# Altium schematic sheet P06_PLP.SchDoc
size 420 x 297 mm
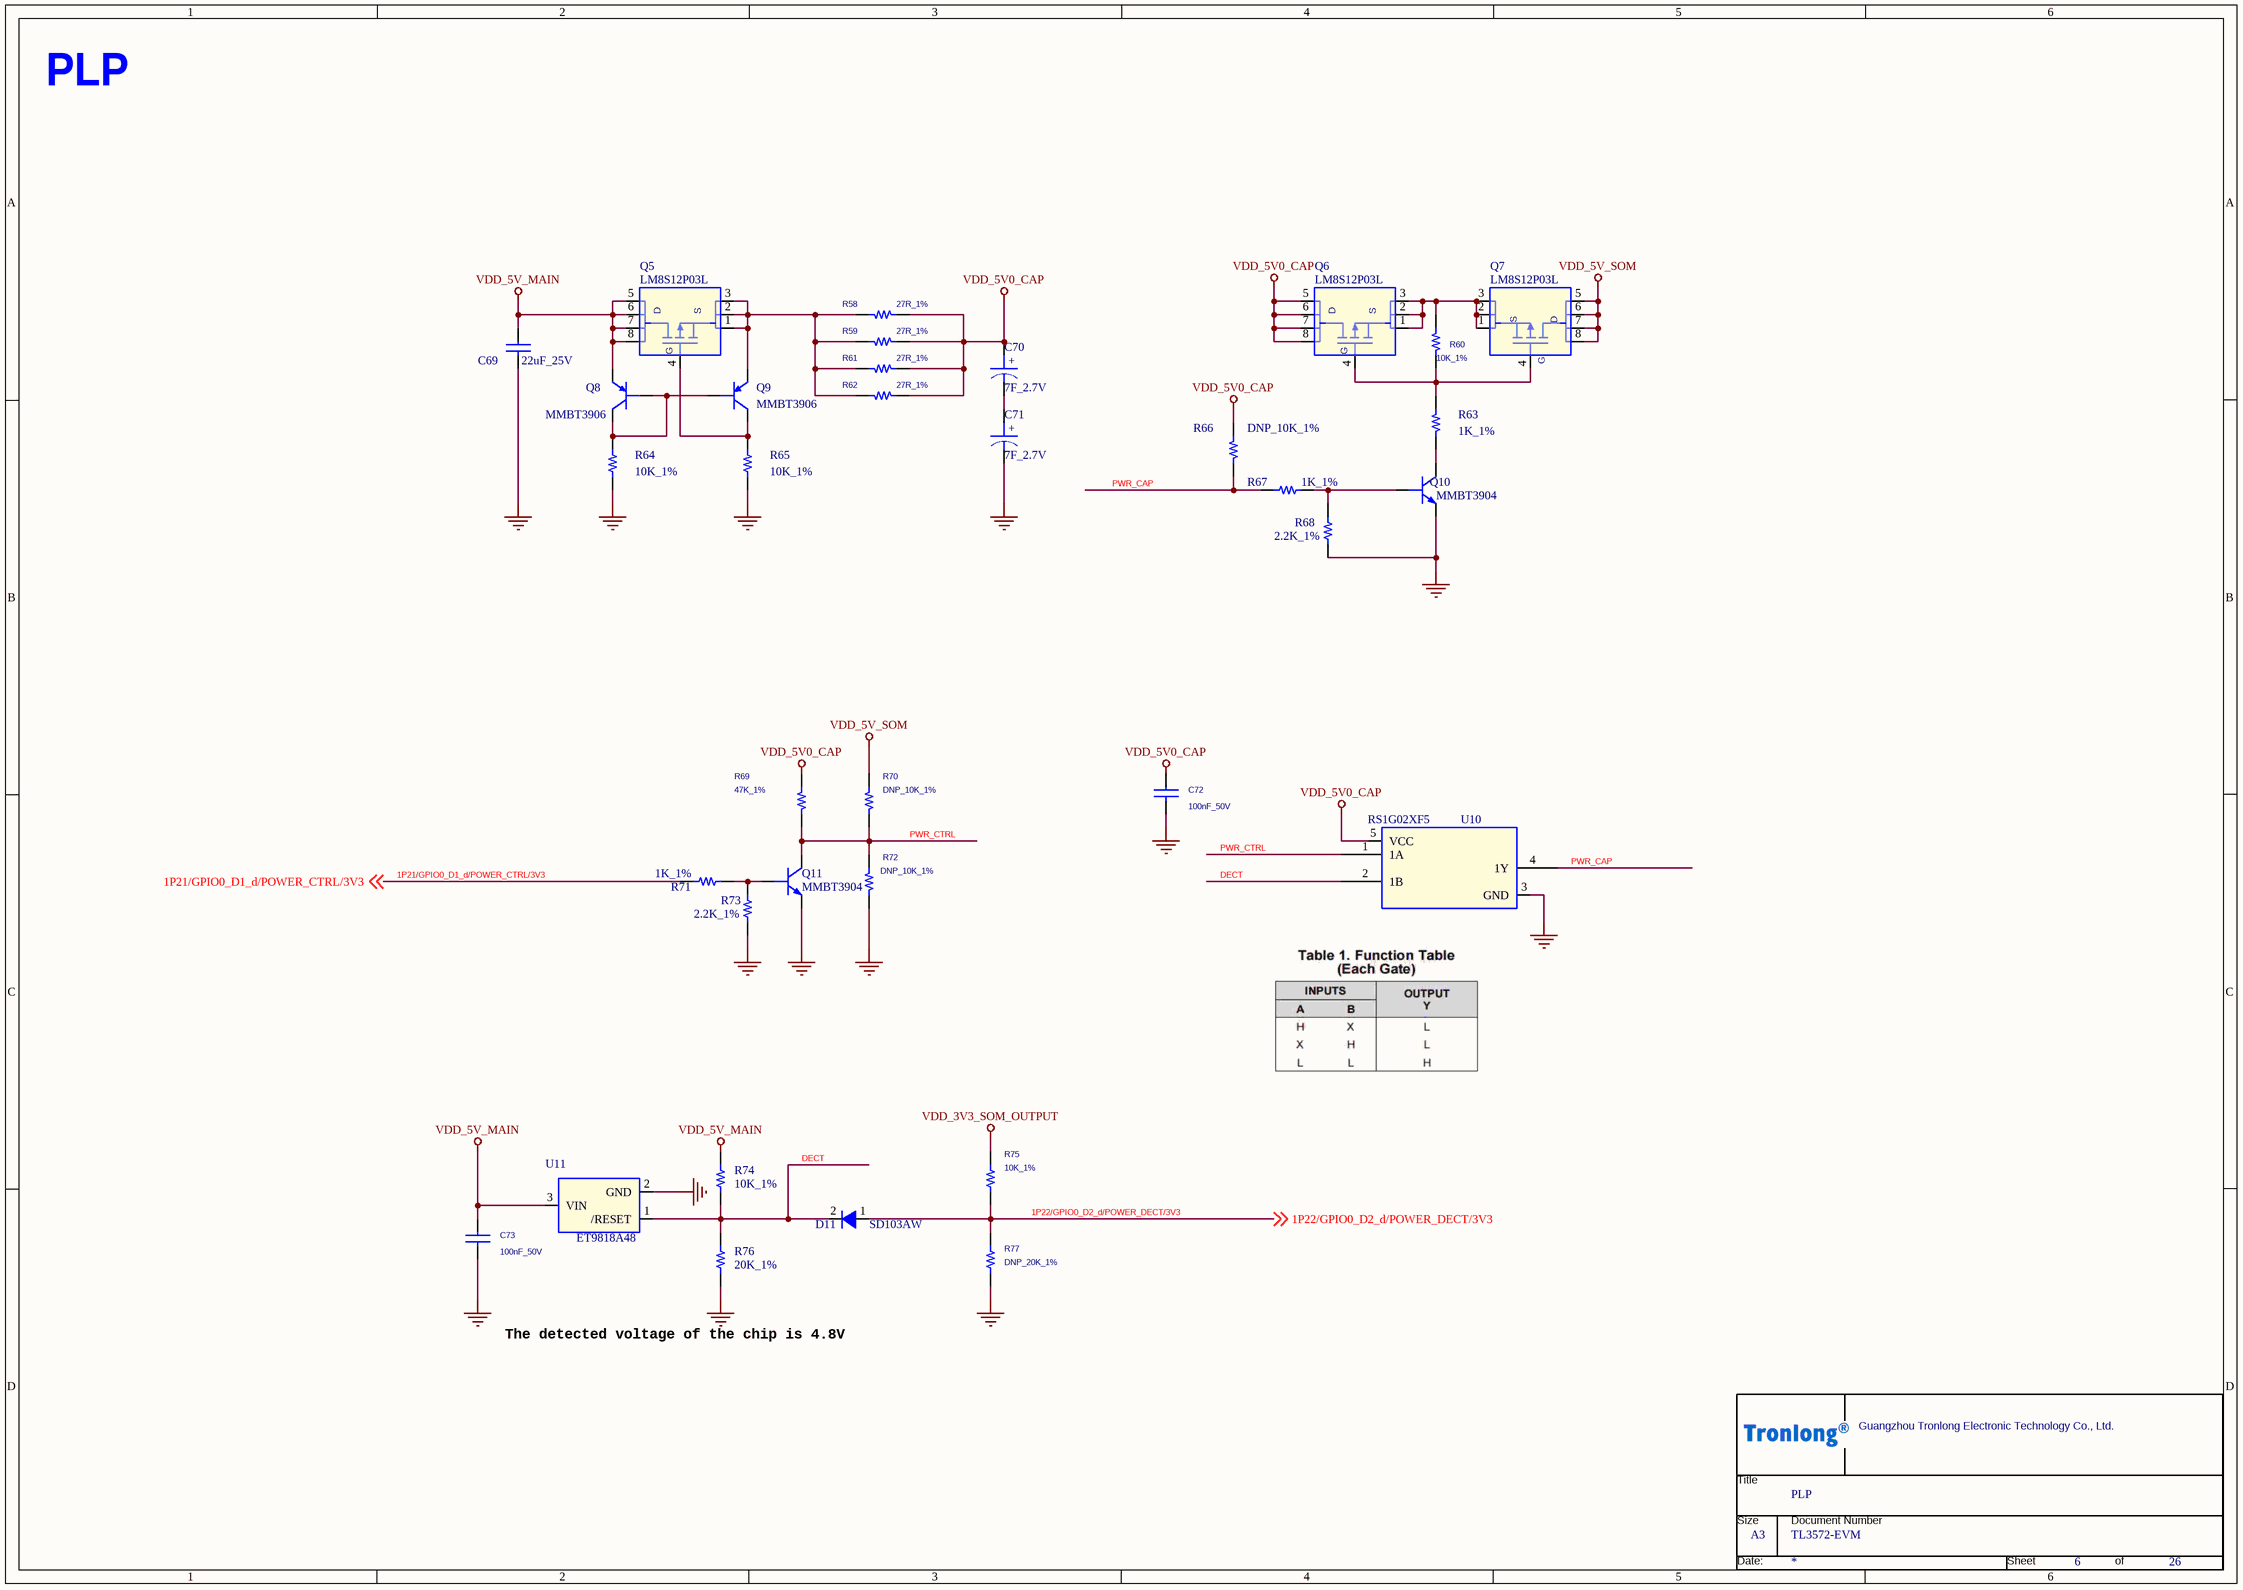
[diagram p0: P06_PLP.SchDoc]

## Parts
*  Page Count: 26  Page Number: 6  Page Size: A3  OrgName: Guangzhou Tronlong Electronic Technology Co., Ltd.  Title: PLP  Doc: TL3572-EVM  (hidden comment: TL_NEW)  (graphical)
C69  22uF_25V  [C0805]
C70  7F_2.7V  [dcc3-5_0-10_5x20_5_0-down]
C71  7F_2.7V  [dcc3-5_0-10_5x20_5_0-down]
C72  100nF_50V  [C0402]
C73  100nF_50V  [C0402]
D11  SD103AW  [SOD-123_NEW]
Q5  LM8S12P03L  [PSOPSOP-8L]
Q6  LM8S12P03L  [PSOPSOP-8L]
Q7  LM8S12P03L  [PSOPSOP-8L]
Q8  MMBT3906  [SOT23-3_DBZ3]
Q9  MMBT3906  [SOT23-3_DBZ3]
Q10  MMBT3904  [SOT23-3_DBZ3]
Q11  MMBT3904  [SOT23-3_DBZ3]
R58  27R_1%  [R2512]
R59  27R_1%  [R2512]
R60  10K_1%  [R0402]
R61  27R_1%  [R2512]
R62  27R_1%  [R2512]
R63  1K_1%  [R0402]
R64  10K_1%  [R0402]
R65  10K_1%  [R0402]
R66  DNP_10K_1%  [R0402]
R67  1K_1%  [R0402]
R68  2.2K_1%  [R0402]
R69  47K_1%  [R0402]
R70  DNP_10K_1%  [R0402]
R71  1K_1%  [R0402]
R72  DNP_10K_1%  [R0402]
R73  2.2K_1%  [R0402]
R74  10K_1%  [R0402]
R75  10K_1%  [R0402]
R76  20K_1%  [R0603]
R77  DNP_20K_1%  [R0402]
U10  RS1G02XF5  [SOT23-5]
U11  ET9818A48  [sot23-3_dbz3_1]

## Nets
GND: C69.2 C71.2 C72.2 C73.2 Q10.2(E) Q11.2(E) R64.1 R65.1 R68.2 R72.2 R73.2 R76.1 R77.2 U10.3(GND) U11.2(GND)
VDD_3V3_SOM_OUTPUT: R75.1
VDD_5V0_CAP: C70.1 C72.1 Q6.5(D1) Q6.6(D2) Q6.7(D3) Q6.8(D4) R58.1 R59.1 R61.1 R62.1 R66.1 R69.1 U10.5(VCC)
VDD_5V_MAIN: C69.1 C73.1 Q5.5(D1) Q5.6(D2) Q5.7(D3) Q5.8(D4) Q8.2(E) R74.2 U11.3(VIN)
VDD_5V_SOM: Q7.5(D1) Q7.6(D2) Q7.7(D3) Q7.8(D4) R70.1
1P21/GPIO0_D1_d/POWER_CTRL/3V3: R71.2 ; off-sheet 1P21/GPIO0_D1_d/POWER_CTRL/3V3
1P22/GPIO0_D2_d/POWER_DECT/3V3: D11.1(Anode) R75.2 R77.1 ; off-sheet 1P22/GPIO0_D2_d/POWER_DECT/3V3
DECT: D11.2(Cathode) R74.1 R76.2 U10.2(1B) U11.1(/RESET)
PWR_CAP: R66.2 R67.2 U10.4(1Y)
PWR_CTRL: Q11.3(C) R69.2 R70.2 R72.1 U10.1(1A)
NetC70_2: C70.2 C71.1
NetQ5_1: Q5.1(S1) Q5.2(S2) Q5.3(S3) Q9.2(E) R58.2 R59.2 R61.2 R62.2
NetQ5_4: Q5.4(G) Q9.3(C) R65.2
NetQ6_1: Q6.1(S1) Q6.2(S2) Q6.3(S3) Q7.1(S1) Q7.2(S2) Q7.3(S3) R60.2
NetQ6_4: Q6.4(G) Q7.4(G) R60.1 R63.2
NetQ8_1: Q8.1(B) Q8.3(C) Q9.1(B) R64.2
NetQ10_1: Q10.1(B) R67.1 R68.1
NetQ10_3: Q10.3(C) R63.1
NetQ11_1: Q11.1(B) R71.1 R73.1

## Notes on the sheet
- PLP
- The detected voltage of the chip is 4.8V
- (in symbol CAP POL_Dup1) +
- (in symbol TL_NEW) Title; Size; Document Number; Date:; Sheet; of
- (in symbol WPM3021) S; D

## Library data of the parts
* = TL_NEW: RevCode: A?; Page Create Date: March  8, 1995; Page Modify Date: *; Document: TL3572-EVM
C69 = CAP NP_Dup2: 贴片陶瓷电容,22uF,20%,25V,X5R; Manufacturer: 广东风华高新科技股份有限公司（FH）; Manufacturer PartNumber: 0805X226M250NT; Manufacturer Character: 中国大陆; ERP Number: 005.0001.0001.00524; As-Welded: /; Operation Temperature（℃）: -55~+85(Ta); Eco-Label: ROHS; PCB Footprint: C0805; Temperature: -55~125℃; ERP PCB Footprint: C0805; Part Status: 优选
C70 C71 = CAP POL_Dup1: 超级电容,7F,2.7V,卧式; Manufacturer PartNumber: HT-2R7-J705UYJ13(G211）; Manufacturer: 锦州凯美能源有限公司（KAMCAP）; Manufacturer Character: 中国大陆; As-Welded: /; room: DCIN; Operation Temperature（℃）: -40~85(Ta); ERP Number: 005.0001.0001.00732; Eco-Label: ROHS; PCB Footprint: dcc3-5_0-10_5x20_5_0-down; Temperature: -55~105℃; Part Status: 试用
C72 C73 = CAP_NP_Dup1: 贴片陶瓷电容,100nF,10%,50V,X7R; Manufacturer PartNumber: 0402B104K500NT; Manufacturer: 广东风华高新科技股份有限公司（FH）; Manufacturer Character: 中国大陆; Eco-Label: ROHS; ERP Number: 005.0001.0001.00681; As-Welded: /; Characteristic: <Characteristic>; Operation Temperature（℃）: -55~+125(Ta); PCB Footprint: C0402; Part Status: 试用; ERP PCB Footprint: C0402; Temperature: -55~125℃
D11 = Diode200mA250V_1: 肖特基二极管,VR=40V,IF=350mA,VF=0.37V@20mA,trr=10ns; TIIntPartnumber: 1E0013; MfrNum: MMSD103T1G; Mfr: On Semiconductor; Manufacturer Character: 中国大陆; Manufacturer: 江苏长晶科技股份有限公司（JSCJ）; DescriptiveText: Diode 200mA 250V 1.25V Forward Drop; PCB Footprint: smd123; Cost10K: 0.07; Cost100: 0.23; Vendor: Digikey; Eco-Label: ROHS; ERP PCB Footprint: SOD-123; ERP Number: 005.0001.0010.00103; Operation Temperature（℃）: -40~+125(Tj); As-Welded: /; PartName: Diode200mA250V; Descriptive_Text: Diode 200mA 250V 1.25V Forward Drop; Temperature: -55~150℃; Manufacturer PartNumber: SD103AW; Part Status: 优选
Q5 = WPM3021: MOSFET,P沟道,VDSS=-30V,VGSS=±20V,ID=-12A,PD=3.1W,VGS(th)=-1.5V; Manufacturer: 上海雷卯电子科技有限公司（Leiditech）; Manufacturer Character: 中国大陆; ERP Number: 005.0001.0009.00040; As-Welded: /; Operation Temperature（℃）: -55~+150(Tj); ERP PCB Footprint: SOP-8L; Eco-Label: ROHS; PCB Footprint: PSOPSOP-8L; Part Status: 测评; Temperature: -40~85℃; Manufacturer PartNumber: LM8S12P03L
Q6 = WPM3021: MOSFET,P沟道,VDSS=-30V,VGSS=±20V,ID=-12A,PD=3.1W,VGS(th)=-1.5V; Manufacturer: 上海雷卯电子科技有限公司（Leiditech）; Manufacturer Character: 中国大陆; Eco-Label: ROHS; ERP PCB Footprint: SOP-8L; As-Welded: /; Operation Temperature（℃）: -55~+150(Tj); ERP Number: 005.0001.0009.00040; PCB Footprint: PSOPSOP-8L; Temperature: -40~85℃; Manufacturer PartNumber: LM8S12P03L; Part Status: 测评
Q7 = WPM3021: MOSFET,P沟道,VDSS=-30V,VGSS=±20V,ID=-12A,PD=3.1W,VGS(th)=-1.5V; Manufacturer Character: 中国大陆; Manufacturer: 上海雷卯电子科技有限公司（Leiditech）; Eco-Label: ROHS; ERP PCB Footprint: SOP-8L; Operation Temperature（℃）: -55~+150(Tj); As-Welded: /; ERP Number: 005.0001.0009.00040; PCB Footprint: PSOPSOP-8L; Manufacturer PartNumber: LM8S12P03L; Temperature: -40~85℃; Part Status: 测评
Q8 = MMBT3904/SOT_0: BJT,PNP,Vceo=-40V,Ic=-200mA,fT=300MHz,PD=200mW; Manufacturer: 江苏长晶科技股份有限公司（JSCJ）; Manufacturer Character: 中国大陆; ERP Number: 005.0001.0008.00005; Operation Temperature（℃）: -55~+150(Tj); As-Welded: /; ERP PCB Footprint: SOT-23; Eco-Label: ROHS; PCB Footprint: SOT23-3_DBZ3; Part Status: 测评; Manufacturer PartNumber: MMBT3906; Temperature: -55~150℃
Q9 = MMBT3904/SOT_0: BJT,PNP,Vceo=-40V,Ic=-200mA,fT=300MHz,PD=200mW; Manufacturer: 江苏长晶科技股份有限公司（JSCJ）; Manufacturer Character: 中国大陆; Eco-Label: ROHS; ERP PCB Footprint: SOT-23; Operation Temperature（℃）: -55~+150(Tj); As-Welded: /; ERP Number: 005.0001.0008.00005; PCB Footprint: SOT23-3_DBZ3; Manufacturer PartNumber: MMBT3906; Temperature: -55~150℃; Part Status: 测评
Q10 = MMBT3904/SOT: BJT,NPN,Vceo=40V,Ic=200mA,fT=300MHz,PD=200mW; Manufacturer Character: 中国大陆; Manufacturer: 江苏长晶科技股份有限公司（JSCJ）; Eco-Label: ROHS; ERP PCB Footprint: SOT-23; ERP Number: 005.0001.0008.00002; As-Welded: /; Operation Temperature（℃）: -55~+150(Tj); PCB Footprint: SOT23-3_DBZ3; Temperature: -55~150℃; Manufacturer PartNumber: MMBT3904; Part Status: 优选
Q11 = MMBT3904/SOT: BJT,NPN,Vceo=40V,Ic=200mA,fT=300MHz,PD=200mW; Manufacturer: 江苏长晶科技股份有限公司（JSCJ）; Manufacturer Character: 中国大陆; Eco-Label: ROHS; ERP PCB Footprint: SOT-23; ERP Number: 005.0001.0008.00002; Operation Temperature（℃）: -55~+150(Tj); As-Welded: /; PCB Footprint: SOT23-3_DBZ3; Manufacturer PartNumber: MMBT3904; Temperature: -55~150℃; Part Status: 优选
R58 R59 R61 R62 = Resistor_Dup3: 25121WF270JT4E; Manufacturer Character: 中国大陆; Manufacturer: 广州创龙; Manufacturer PartNumber: 27R,±1%,R2512,≥1W; CLASS: DISCRETE; ERP Number: 005.0001.0023.00619; Operation Temperature（℃）: -40~+85(Ta); As-Welded: /; Eco-Label: ROHS; PCB Footprint: R2512; ERP PCB Footprint: R2512; Part Status: -
R60 = Resistor_Dup3: 贴片电阻,10K,±1%,1/16W; Manufacturer Character: 中国大陆; Manufacturer: 广东风华高新科技股份有限公司（FH）; Manufacturer PartNumber: RC-02K1002FT; CLASS: DISCRETE; ERP Number: 005.0001.0002.01326; Operation Temperature（℃）: -55~+125(Ta); As-Welded: /; Eco-Label: ROHS; PCB Footprint: R0402; ERP PCB Footprint: R0402; Part Status: 优选
R63 = Resistor_Dup3: 贴片电阻,1K,±1%,1/16W; Manufacturer PartNumber: RC-02K1001FT; Manufacturer: 广东风华高新科技股份有限公司（FH）; Manufacturer Character: 中国大陆; CLASS: DISCRETE; Eco-Label: ROHS; As-Welded: /; Operation Temperature（℃）: -55~+125(Ta); ERP Number: 005.0001.0002.01327; PCB Footprint: R0402; Part Status: 优选; ERP PCB Footprint: R0402; Temperature: -55~155℃
R64 = Resistor_Dup3: 贴片电阻,10K,±1%,1/16W; Manufacturer PartNumber: RC-02K1002FT; Manufacturer: 广东风华高新科技股份有限公司（FH）; Manufacturer Character: 中国大陆; CLASS: DISCRETE; Eco-Label: ROHS; Operation Temperature（℃）: -55~+125(Ta); As-Welded: /; ERP Number: 005.0001.0002.01326; PCB Footprint: R0402; Part Status: 优选; ERP PCB Footprint: R0402; Temperature: -55~155℃
R65 R74 = Resistor_Dup3: 贴片电阻,10K,±1%,1/16W; Manufacturer Character: 中国大陆; Manufacturer: 广东风华高新科技股份有限公司（FH）; Manufacturer PartNumber: RC-02K1002FT; CLASS: DISCRETE; ERP Number: 005.0001.0002.01326; As-Welded: /; Operation Temperature（℃）: -55~+125(Ta); Eco-Label: ROHS; PCB Footprint: R0402; Temperature: -55~155℃; ERP PCB Footprint: R0402; Part Status: 优选
R66 = Resistor_Dup3: 贴片电阻,10K,±1%,1/16W; Manufacturer: 广东风华高新科技股份有限公司（FH）; Manufacturer PartNumber: RC-02K1002FT; Manufacturer Character: 中国大陆; CLASS: DISCRETE; As-Welded: DNP; Operation Temperature（℃）: -55~+125(Ta); ERP Number: 005.0001.0002.01326; Eco-Label: ROHS; PCB Footprint: R0402; Part Status: 优选; ERP PCB Footprint: R0402; Temperature: –55~155℃
R67 = Resistor_Dup3: 贴片电阻,1K,±1%,1/16W; Manufacturer Character: 中国大陆; Manufacturer: 广东风华高新科技股份有限公司（FH）; Manufacturer PartNumber: RC-02K1001FT; CLASS: DISCRETE; ERP Number: 005.0001.0002.01327; Operation Temperature（℃）: -55~+125(Ta); As-Welded: /; Eco-Label: ROHS; PCB Footprint: R0402; ERP PCB Footprint: R0402; Part Status: 优选
R68 = Resistor_Dup3: 贴片电阻,2.2K,±1%,1/16W; Manufacturer Character: 中国大陆; Manufacturer PartNumber: RC-02K2201FT; Manufacturer: 广东风华高新科技股份有限公司（FH）; CLASS: DISCRETE; As-Welded: /; Operation Temperature（℃）: -55~+125(Ta); ERP Number: 005.0001.0002.01317; Eco-Label: ROHS; PCB Footprint: R0402; Part Status: 试用; ERP PCB Footprint: R0402
R69 = Resistor_Dup3: 贴片电阻,47K,±1%,1/16W; Manufacturer Character: 中国大陆; Manufacturer: 广东风华高新科技股份有限公司（FH）; Manufacturer PartNumber: RC-02K4702FT; CLASS: DISCRETE; ERP Number: 005.0001.0002.01331; Operation Temperature（℃）: -55~+125(Ta); As-Welded: /; Eco-Label: ROHS; PCB Footprint: R0402; ERP PCB Footprint: R0402; Part Status: 试用
R70 = Resistor_Dup3: 贴片电阻,10K,±1%,1/16W; Manufacturer PartNumber: RC-02K1002FT; Manufacturer: 广东风华高新科技股份有限公司（FH）; Manufacturer Character: 中国大陆; CLASS: DISCRETE; Eco-Label: ROHS; As-Welded: DNP; Operation Temperature（℃）: -55~+125(Ta); ERP Number: 005.0001.0002.01326; PCB Footprint: R0402; ERP PCB Footprint: R0402; Part Status: 优选
R71 = Resistor_Dup3: 贴片电阻,1K,±1%,1/16W; Manufacturer Character: 中国大陆; Manufacturer: 广东风华高新科技股份有限公司（FH）; Manufacturer PartNumber: RC-02K1001FT; CLASS: DISCRETE; Eco-Label: ROHS; ERP Number: 005.0001.0002.01327; Operation Temperature（℃）: -55~+125(Ta); As-Welded: /; PCB Footprint: R0402; Part Status: 优选; ERP PCB Footprint: R0402
R72 = Resistor_Dup3: 贴片电阻,10K,±1%,1/16W; Manufacturer Character: 中国大陆; Manufacturer: 广东风华高新科技股份有限公司（FH）; Manufacturer PartNumber: RC-02K1002FT; CLASS: DISCRETE; ERP Number: 005.0001.0002.01326; Operation Temperature（℃）: -55~+125(Ta); As-Welded: DNP; Eco-Label: ROHS; PCB Footprint: R0402; ERP PCB Footprint: R0402; Part Status: 优选
R73 = Resistor_Dup3: 贴片电阻,2.2K,±1%,1/16W; Manufacturer: 广东风华高新科技股份有限公司（FH）; Manufacturer PartNumber: RC-02K2201FT; Manufacturer Character: 中国大陆; CLASS: DISCRETE; ERP Number: 005.0001.0002.01317; Operation Temperature（℃）: -55~+125(Ta); As-Welded: /; Eco-Label: ROHS; PCB Footprint: R0402; Part Status: 试用; ERP PCB Footprint: R0402
R75 = Resistor_Dup3: 贴片电阻,10K,±1%,1/16W; Manufacturer PartNumber: RC-02K1002FT; Manufacturer: 广东风华高新科技股份有限公司（FH）; Manufacturer Character: 中国大陆; CLASS: DISCRETE; Eco-Label: ROHS; As-Welded: /; Operation Temperature（℃）: -55~+125(Ta); ERP Number: 005.0001.0002.01326; PCB Footprint: R0402; ERP PCB Footprint: R0402; Part Status: 优选
R76 = Resistor_Dup3: 贴片电阻,20K,±1%,1/10W; Manufacturer PartNumber: RS-03K2002FT; Manufacturer: 广东风华高新科技股份有限公司（FH）; Manufacturer Character: 中国大陆; CLASS: DISCRETE; ERP Number: 005.0001.0002.01054; Operation Temperature（℃）: -55~+155(Ta); As-Welded: /; Eco-Label: ROHS; PCB Footprint: R0603; Part Status: 优选; Temperature: -55~155℃; ERP PCB Footprint: R0603
R77 = Resistor_Dup3: 贴片电阻,20K,±1%,1/16W; Manufacturer Character: 中国大陆; Manufacturer: 广东风华高新科技股份有限公司（FH）; Manufacturer PartNumber: RC-02K2002FT; CLASS: DISCRETE; ERP Number: 005.0001.0002.01357; Operation Temperature（℃）: -55~+125(Ta); As-Welded: DNP; Eco-Label: ROHS; PCB Footprint: R0402; ERP PCB Footprint: R0402; Part Status: 试用
U10 = SN74LVC2G86DCUR _0: 1个两输入或非门; Manufacturer Character: 中国大陆; Manufacturer: 江苏润石科技有限公司（RUNIC）; Operation Temperature（℃）: -40~+125(Ta); As-Welded: /; ERP Number: 005.0001.0004.01183; Eco-Label: ROHS; PCB Footprint: SOT23-5; Part Status: 测评; Manufacturer PartNumber: RS1G02XF5; ERP PCB Footprint: SOT23-5
U11 = WD1304E30_0: 电源监控,4.8V,阈值电压4.7V; Manufacturer: 无锡力芯微电子股份有限公司（ETEK）; Manufacturer Character: 中国大陆; Eco-Label: ROHS; ERP PCB Footprint: SOT23-3L; ERP Number: 005.0001.0019.00043; As-Welded: /; Operation Temperature（℃）: -40~+85(Ta); PCB Footprint: sot23-3_dbz3_1; Manufacturer PartNumber: ET9818A48; Temperature: -40~85℃; Part Status: 测评